# EAGLE design bme590_milestone04 (EAGLE 9.2.0)
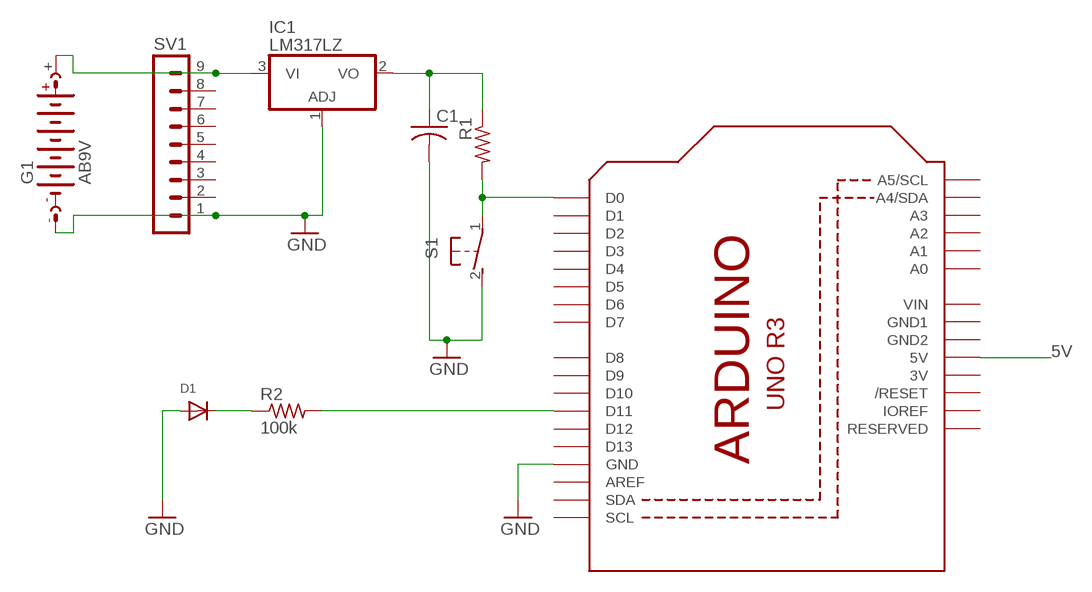
[diagram p0: schematic, sheet 1]

## Parts
C1  C-USC0805  [C0805]
D1  DIODEDO-1N4148  [DO-1N4148]
G1  AB9V  [AB9V]
IC1  LM317LZ  [TO92]
R1  R-US_M0805  [M0805]
R2  100k  R-US_R0805  [R0805]
S1  31-XX  [B3F-31XX]
SV1  MA09-1W  [MA09-1W]
U1  ARDUINOR3-DIMENSION  [ARDUINOR3]

## Nets
5V: U1.5V
GND: C1.2 D1.A G1.- IC1.1(ADJ) S1.2(S) SV1.1 U1.GND
N$1: G1.+ IC1.3(VI) SV1.9
N$2: R2.2 U1.D11
N$3: C1.1 IC1.2(VO) R1.1
N$4: R1.2 S1.1(P) U1.D0
N$5: D1.C R2.1
Unconnected: SV1.2 SV1.3 SV1.4 SV1.5 SV1.6 SV1.7 SV1.8 U1.A0 U1.A1 U1.A2 U1.A3 U1.A4(A4/SDA) U1.A5(A5/SCL) U1.AREF U1.D1 U1.D2 U1.D3 U1.D4 U1.D5 U1.D6 U1.D7 U1.D8 U1.D9 U1.D10 U1.D12 U1.D13 U1.IOREF U1.RESERVED U1.RESET(/RESET) U1.SCL U1.SDA

## Power pins joined to a net without a drawn wire
3V: U1.3V
GND1: U1.GND1
GND2: U1.GND2
VIN: U1.VIN

## Library data of the parts
C1 = adafruit:C-US: CAPACITOR, American symbol
D1 = adafruit:DIODE: Diode SMADIODE - SMA Surface Mount Package 20V 1A Schottky Diode Digikey: 641-1014-6-ND DO-1N4148 - Through Hole Small Current Diode SOD-123 20V 1 A (.5mV Vf) Schottky Diode - Digikey: MBRX120TPMSCT-ND SOD-323 10V 570mA (.38mV Vf, 3ns) Schottky Diode - Digikey: ZLLS410CT-ND SOD-523 30V 30mA Schottky Diode (RB751S-40TE61) - Digikey: RB751S-40TE61CT-ND SOT23-R/W - SOT23 Package (R = Solder Paste/Reflow Ovens, W = Hand-Soldering) BAT54Film 40V 300mA - Digikey: 497-7162-1-ND
G1 = battery:AB9V: 9-V BATTERY CLIP
IC1 = linear:*317: Positive VOLTAGE REGULATOR
R1 R2 = adafruit:R-US_: RESISTOR, American symbol
S1 = adafruit:31-XX: OMRON SWITCH Now with beefier pads!
SV1 = con-lstb:MA09-1W: PIN HEADER; OC_FARNELL: unknown; OC_NEWARK: unknown
U1 = adafruit:ARDUINOR3: This is a new object for the new Arduino R3 - with extra pins that you may want to use (such as IOref, and duplicated A4/A5

## Net classes
0 default: width 0.305 mm, drill 0.508 mm, clearance 0.305 mm

## Board
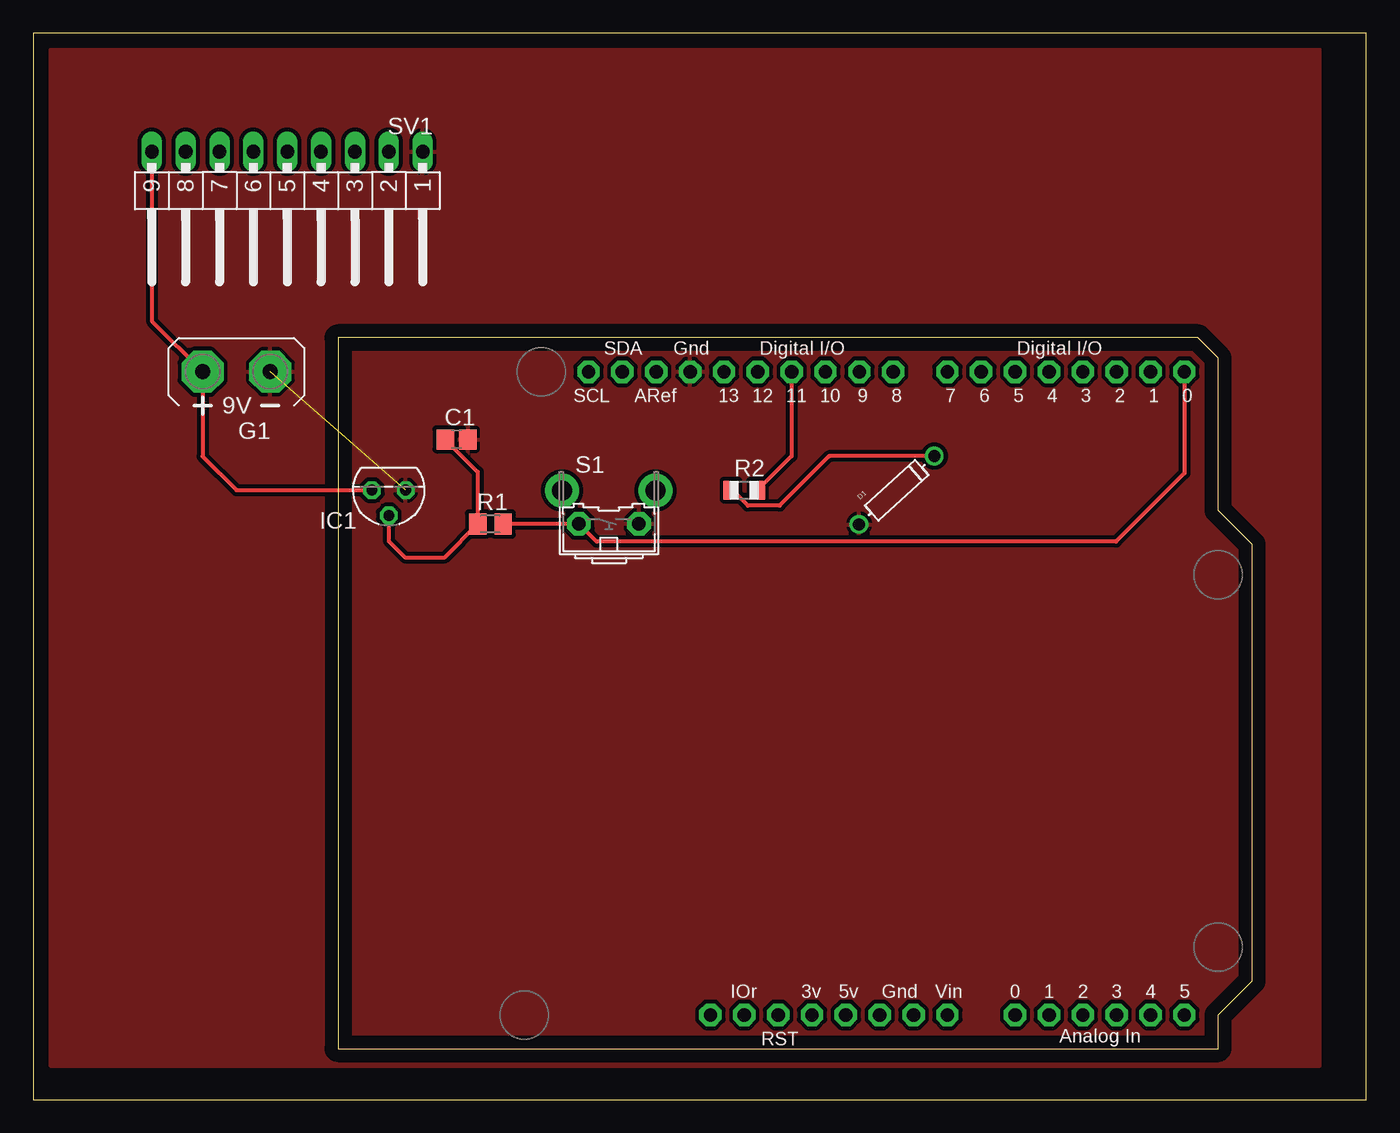
[diagram p1: board, top side]

Size 100 x 80 mm. Coordinates in mm from the lower left corner, seen from the top.
Outline: 0,0 100,0 100,80 0,80 0,0
Copper layers (1*16): Top 0.035mm / dielectric 1.5mm / Bottom 0.035mm
Design rules "default": minimum track width 6mil, minimum drill 0.35mm, track to track 6mil, track to pad 6mil, pad to pad 6mil, via to via 6mil, smd to smd 6mil, copper to edge 40mil, drill to drill 6mil, minimum pad ring 10mil, minimum via ring 8mil, stop-mask expansion 4mil, vias tented up to drill 0mil, thermal gap 10mil

### Footprints (pad centres in the part's own frame; a part is rotated, then mirrored left to right if it is on the bottom)
C0805 = smd 1.3 x 1.5: 1 -0.85,0; 2 0.85,0
DO-1N4148 = drill 0.9: A -3.81,0; C 3.81,0
AB9V = drill 1.118 pad 3.15 octagon: + 0,2.54; - 0,-2.54
TO92 = drill 0.813 octagon: 1 -1.27,0; 2 0,1.905; 3 1.27,0
M0805 = smd 1.3 x 1.6: 1 -0.95,0; 2 0.95,0
R0805 = smd 1.1 x 1.4: 1 -1,0; 2 1,0
B3F-31XX = drill 1.016 pad 1.778 octagon: 1 -2.261,-1.245; 2 2.261,-1.245 | drill 1.499 pad 2.54: 3 -3.505,1.245; 4 3.505,1.245
MA09-1W = drill 1.016 long: 1 -10.16,0; 2 -7.62,0; 3 -5.08,0; 4 -2.54,0; 5 0,0; 6 2.54,0; 7 5.08,0; 8 7.62,0; 9 10.16,0
ARDUINOR3 = drill 1 pad 1.676 octagon: 3V 35.56,2.54; 5V 38.1,2.54; A0 50.8,2.54; A1 53.34,2.54; A2 55.88,2.54; A3 58.42,2.54; A4 60.96,2.54; A5 63.5,2.54; AREF 23.876,50.8; D0 63.5,50.8; D1 60.96,50.8; D2 58.42,50.8; D3 55.88,50.8; D4 53.34,50.8; D5 50.8,50.8; D6 48.26,50.8; D7 45.72,50.8; D8 41.656,50.8; D9 39.116,50.8; D10 36.576,50.8; D11 34.036,50.8; D12 31.496,50.8; D13 28.956,50.8; GND 26.416,50.8; GND1 43.18,2.54; GND2 40.64,2.54; IOREF 30.48,2.54; RESERVED 27.94,2.54; RESET 33.02,2.54; SCL 18.796,50.8; SDA 21.336,50.8; VIN 45.72,2.54

### Placement (x,y rotation side)
C1  31.75,49.53 0 top
D1  64.77,45.72 42.2 top
G1  15.24,54.61 90 top
IC1  26.67,45.72 180 top
R1  34.29,43.18 0 top
R2  53.34,45.72 0 top
S1  43.18,44.45 0 top
SV1  19.05,71.12 180 top
U1  22.86,3.81 0 top

### Tracks (layer width: path | path; a pad name or v marks a point on that pad's centre or on a via)
GND  (1 unrouted)
  Top 0.305: 45.47,43.18 S1.2
  pour Top: 1.27,78.74 1.27,2.54 96.52,2.54 96.52,78.74
N$1
  Top 0.305: SV1.9 8.89,58.42 G1.+ 12.7,48.26 15.24,45.72 IC1.3
N$2
  Top 0.305: 56.9,54.86 U1.D11 56.9,48.28 R2.2
N$3
  Top 0.305: C1.1 33.34,47.09 R1.1 30.8,40.64 27.94,40.64 26.67,41.91 IC1.2
N$4
  Top 0.305: U1.D0 86.36,46.99 81.23,41.86 42.27,41.86 S1.1 40.89,43.18 R1.2
N$5
  Top 0.305: D1.C 59.71,48.28 55.99,44.56 53.6,44.56 52.44,45.72 R2.1